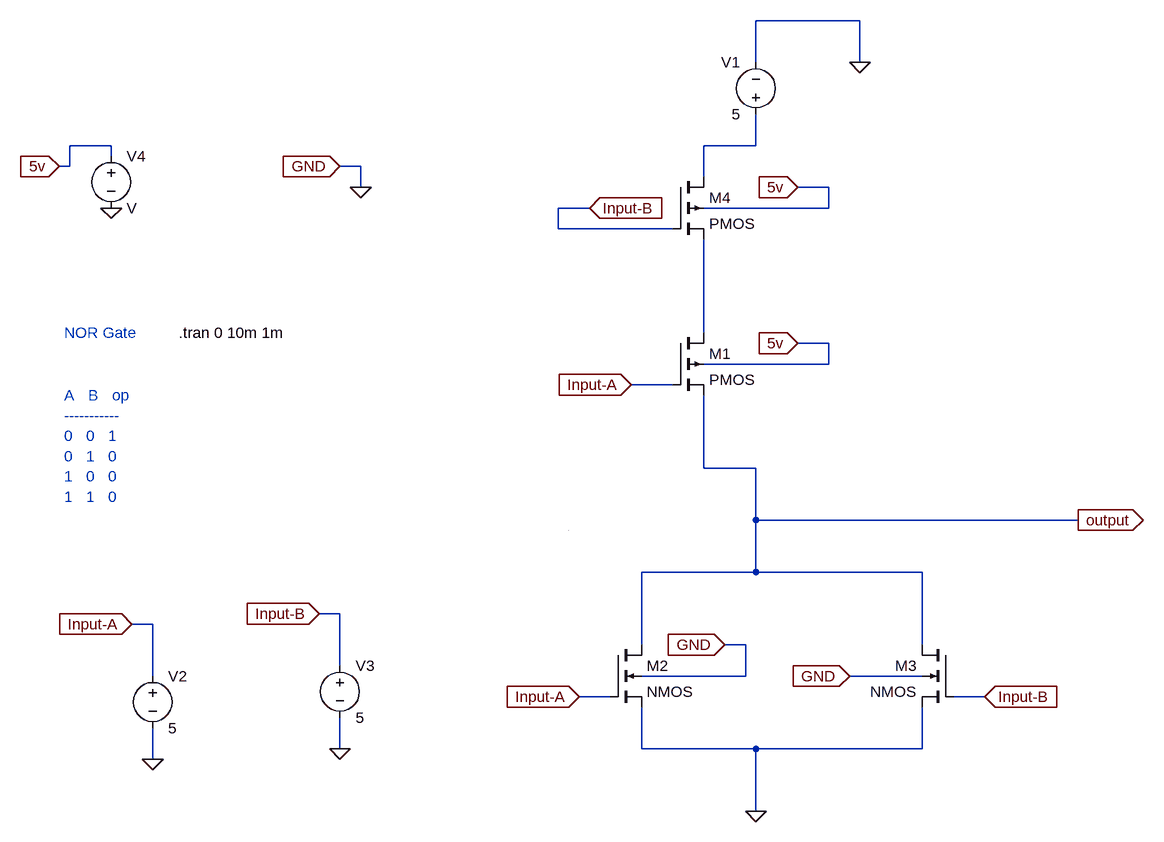
[diagram p0: schematic 3_NOR_gate.asc]
3_NOR_gate.asc, the LTspice schematic file:
Version 4.1
SHEET 1 920 680
WIRE 448 -784 288 -784
WIRE 288 -720 288 -784
WIRE 448 -720 448 -784
WIRE -704 -592 -768 -592
WIRE 288 -592 288 -640
WIRE 288 -592 208 -592
WIRE -704 -576 -704 -592
WIRE -768 -560 -768 -592
WIRE -768 -560 -784 -560
WIRE -320 -560 -352 -560
WIRE 208 -544 208 -592
WIRE -320 -528 -320 -560
WIRE 400 -528 352 -528
WIRE 32 -496 -16 -496
WIRE 400 -496 400 -528
WIRE 400 -496 208 -496
WIRE -16 -464 -16 -496
WIRE 160 -464 -16 -464
WIRE 208 -304 208 -448
WIRE 400 -288 352 -288
WIRE 400 -256 400 -288
WIRE 400 -256 208 -256
WIRE 160 -224 96 -224
WIRE 208 -96 208 -208
WIRE 288 -96 208 -96
WIRE 288 -16 288 -96
WIRE 784 -16 288 -16
WIRE 288 64 288 -16
WIRE 288 64 112 64
WIRE 544 64 288 64
WIRE -352 128 -384 128
WIRE -640 144 -672 144
WIRE 112 176 112 64
WIRE 272 176 240 176
WIRE 544 176 544 64
WIRE -352 208 -352 128
WIRE -640 224 -640 144
WIRE 272 224 272 176
WIRE 272 224 112 224
WIRE 544 224 432 224
WIRE 64 256 16 256
WIRE 640 256 592 256
WIRE -352 336 -352 288
WIRE 112 336 112 272
WIRE 288 336 112 336
WIRE 544 336 544 272
WIRE 544 336 288 336
WIRE -640 352 -640 304
WIRE 288 432 288 336
WIRE 0 0 0 0
FLAG -640 352 0
FLAG 784 -16 output
IOPIN 784 -16 Out
FLAG 448 -720 0
FLAG 288 432 0
FLAG -672 144 Input-A
IOPIN -672 144 In
FLAG -352 336 0
FLAG -384 128 Input-B
IOPIN -384 128 In
FLAG 96 -224 Input-A
IOPIN 96 -224 In
FLAG 16 256 Input-A
IOPIN 16 256 In
FLAG 640 256 Input-B
IOPIN 640 256 In
FLAG 32 -496 Input-B
IOPIN 32 -496 In
FLAG -352 -560 GND
IOPIN -352 -560 In
FLAG -320 -528 0
FLAG -704 -496 0
FLAG -784 -560 5v
IOPIN -784 -560 In
FLAG 352 -528 5v
IOPIN 352 -528 In
FLAG 352 -288 5v
IOPIN 352 -288 In
FLAG 432 224 GND
IOPIN 432 224 In
FLAG 240 176 GND
IOPIN 240 176 In
SYMBOL pmos4 160 -304 R0
SYMATTR InstName M1
SYMBOL nmos4 64 176 R0
SYMATTR InstName M2
SYMBOL voltage -640 208 R0
WINDOW 123 0 0 Left 0
WINDOW 39 0 0 Left 0
SYMATTR InstName V2
SYMATTR Value 5
SYMBOL nmos4 592 176 M0
SYMATTR InstName M3
SYMBOL pmos4 160 -544 R0
SYMATTR InstName M4
SYMBOL voltage 288 -624 R180
WINDOW 0 24 96 Left 2
WINDOW 3 24 16 Left 2
WINDOW 123 0 0 Left 0
WINDOW 39 0 0 Left 0
SYMATTR InstName V1
SYMATTR Value 5
SYMBOL voltage -352 192 R0
WINDOW 123 0 0 Left 0
WINDOW 39 0 0 Left 0
SYMATTR InstName V3
SYMATTR Value 5
SYMBOL voltage -704 -592 R0
SYMATTR InstName V4
TEXT -600 -304 Left 2 !.tran 0 10m 1m
TEXT -776 -304 Left 2 ;NOR Gate
TEXT -776 -208 Left 2 ;A   B   op\n-----------\n0   0   1\n0   1   0\n1   0   0\n1   1   0

The netlist it stands for:
* 3_NOR_gate.asc
M1 N002 Input-A output 5v PMOS
M2 output Input-A 0 0 NMOS
V2 Input-A 0 5
M3 output Input-B 0 0 NMOS
M4 N001 Input-B N002 5v PMOS
V1 N001 0 5
V3 Input-B 0 5
V4 5v 0 V
.model NMOS NMOS
.model PMOS PMOS
.lib standard.mos
.tran 0 10m 1m
* NOR Gate
* A   B   op
* -----------
* 0   0   1
* 0   1   0
* 1   0   0
* 1   1   0
.backanno
.end